# EAGLE schematic adc_microboard (EAGLE 6.2)

## Sheet 1 of 2
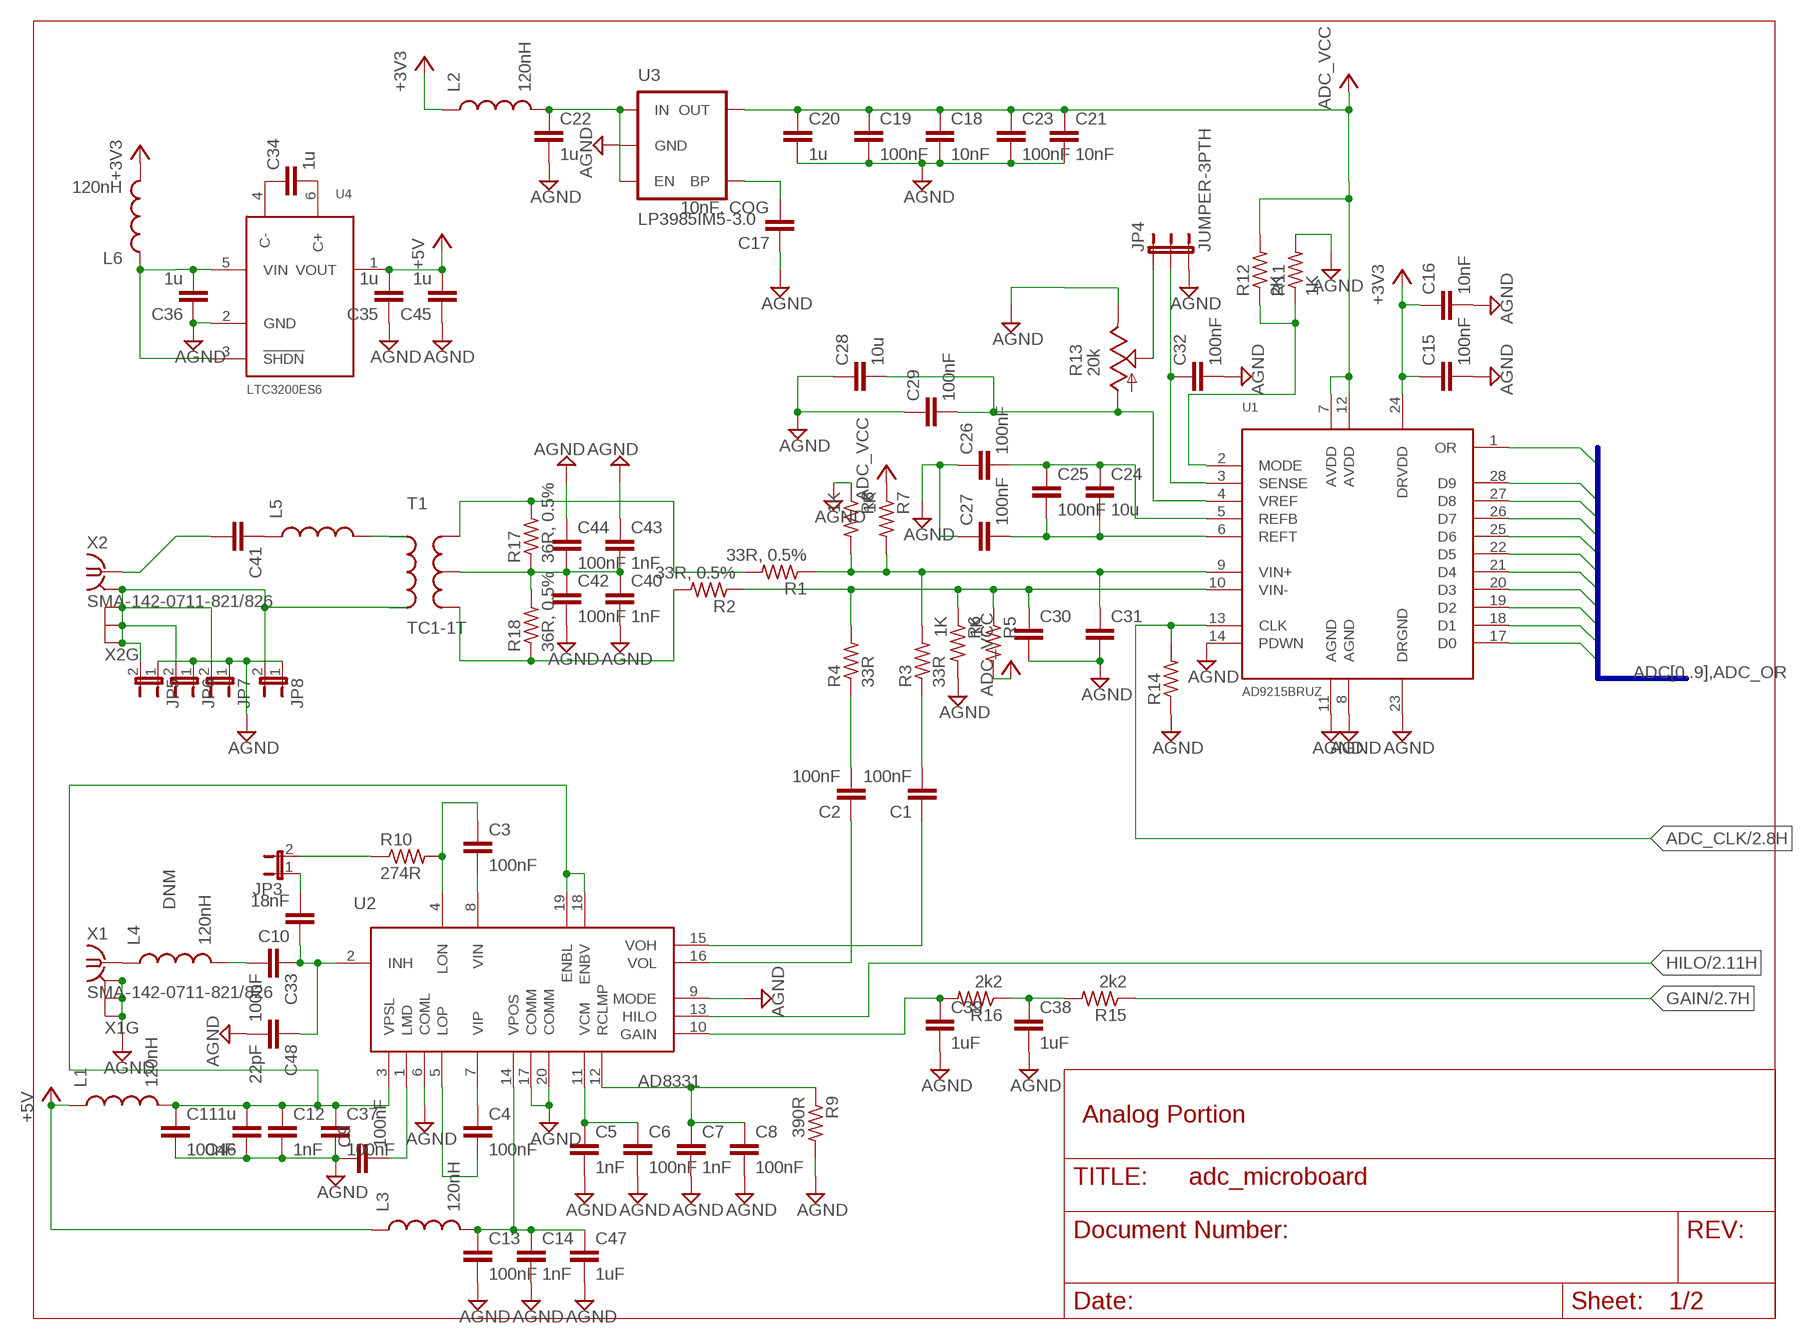
[diagram p0: schematic, sheet 1]

### Parts
C1  100nF  C-EUC0603K  [C0603K]
C2  100nF  C-EUC0603K  [C0603K]
C3  100nF  C-EUC0402  [C0402]
C4  100nF  C-EUC0402  [C0402]
C5  1nF  C-EUC0402  [C0402]
C6  100nF  C-EUC0402  [C0402]
C7  1nF  C-EUC0402  [C0402]
C8  100nF  C-EUC0402  [C0402]
C9  100nF  C-EUC0402  [C0402]
C10  18nF  C-EUC0603  [C0603]
C11  100nF  C-EUC0402  [C0402]
C12  1nF  C-EUC0402  [C0402]
C13  100nF  C-EUC0402  [C0402]
C14  1nF  C-EUC0402  [C0402]
C15  100nF  C-EUC0402  [C0402]
C16  10nF  C-EUC0402  [C0402]
C17  10nF, COG  C-EUC0402  [C0402]
C18  10nF  C-EUC0402  [C0402]
C19  100nF  C-EUC0402  [C0402]
C20  1u  C-EUC0603  [C0603]
C21  10nF  C-EUC0402  [C0402]
C22  1u  C-EUC0603  [C0603]
C23  100nF  C-EUC0402  [C0402]
C24  10u  C-EUC0603  [C0603]
C25  100nF  C-EUC0402  [C0402]
C26  100nF  C-EUC0402  [C0402]
C27  100nF  C-EUC0402  [C0402]
C28  10u  C-EUC0603  [C0603]
C29  100nF  C-EUC0402  [C0402]
C30  C-EUC0402  [C0402]
C31  C-EUC0402  [C0402]
C32  100nF  C-EUC0402  [C0402]
C33  100nF  C-EUC0603K  [C0603K]
C34  1u  C-EUC0603  [C0603]
C35  1u  C-EUC0603  [C0603]
C36  1u  C-EUC0603  [C0603]
C37  100nF  C-EUC0402  [C0402]
C38  1uF  C-EUC0603  [C0603]
C39  1uF  C-EUC0603  [C0603]
C40  1nF  C-EUC0402  [C0402]
C41  C-EUC0603K  [C0603K]
C42  100nF  C-EUC0402  [C0402]
C43  1nF  C-EUC0402  [C0402]
C44  100nF  C-EUC0402  [C0402]
C45  1u  C-EUC0603  [C0603]
C46  1u  C-EUC0402  [C0402]
C47  1uF  C-EUC0402  [C0402]
C48  22pF  C-EUC0603  [C0603]
JP3  JUMPER-2SMD-NC  [SJ_2S]
JP4  JUMPER-3PTH  [1X03]
JP5  JUMPER-2SMD-NC  [SJ_2S]
JP6  JUMPER-2SMD-NC  [SJ_2S]
JP7  JUMPER-2SMD-NC  [SJ_2S]
JP8  JUMPER-2SMD-NC  [SJ_2S]
L1  120nH  INDUCTOR0603  [0603]
L2  120nH  INDUCTOR0603  [0603]
L3  120nH  INDUCTOR0603  [0603]
L4  120nH  INDUCTOR0603  [0603]
L5  INDUCTOR0603  [0603]
L6  120nH  INDUCTOR0603  [0603]
R1  33R, 0.5%  R-US_R0603  [R0603]
R2  33R, 0.5%  R-US_R0603  [R0603]
R3  33R  R-US_R0603  [R0603]
R4  33R  R-US_R0603  [R0603]
R5  1K  R-US_R0402  [R0402]
R6  1K  R-US_R0402  [R0402]
R7  1K  R-US_R0402  [R0402]
R8  1K  R-US_R0402  [R0402]
R9  390R  R-US_R0603  [R0603]
R10  274R  R-US_R0603  [R0603]
R11  1K  R-US_R0402  [R0402]
R12  2K  R-US_R0603  [R0603]
R13  20k  TRIM_US-3361P  [3361P]
R14  R-US_R0603  [R0603]
R15  2k2  R-US_R0603  [R0603]
R16  2k2  R-US_R0603  [R0603]
R17  36R, 0.5%  R-US_R0603  [R0603]
R18  36R, 0.5%  R-US_R0603  [R0603]
T1  TC1-1T  [AT224-1A]
U1  AD9215BRUZ  [TSSOP28]
U2  AD8331  [QSOP20]
U3  LP3985IM5-3.0  V_REG_LDOSMD  [SOT23-5]
U4  LTC3200ES6  [SOT23-6L]
X1  SMA-142-0711-821/826  [J502-ND-142-0711-821/826]
X2  SMA-142-0711-821/826  [J502-ND-142-0711-821/826]

### Nets
+3V3: C15.1 C16.1 L2.1 L6.2 U1.24(DRVDD) ; also sheet 2
+5V: C35.2 C45.2 L1.1 L3.1 U4.1(VOUT)
ADC0: U1.17(D0) ; also sheet 2
ADC1: U1.18(D1) ; also sheet 2
ADC2: U1.19(D2) ; also sheet 2
ADC3: U1.20(D3) ; also sheet 2
ADC4: U1.21(D4) ; also sheet 2
ADC5: U1.22(D5) ; also sheet 2
ADC6: U1.25(D6) ; also sheet 2
ADC7: U1.26(D7) ; also sheet 2
ADC8: U1.27(D8) ; also sheet 2
ADC9: U1.28(D9) ; also sheet 2
ADC_CLK: R14.2 U1.13(CLK) ; also sheet 2
ADC_OR: U1.1(OR) ; also sheet 2
ADC_VCC: C18.1 C19.1 C20.1 C21.1 C23.1 R5.2 R7.1 R12.2 U1.7(AVDD) U1.12(AVDD) U3.5(OUT)
AGND: C5.2 C6.2 C7.2 C8.2 C9.1 C11.2 C12.2 C13.2 C14.2 C15.2 C16.2 C17.1 C18.2 C19.2 C20.2 C21.2 C22.2 C23.2 C26.1 C27.1 C28.1 C29.1 C30.2 C31.2 C32.2 C35.1 C36.1 C37.2 C38.2 C39.2 C40.2 C42.2 C43.1 C44.1 C45.1 C46.1 C47.2 C48.2 JP4.3 JP5.1 JP6.1 JP7.1 JP8.1 R6.2 R8.1 R9.2 R11.2 R13.1(E) R14.1 U1.8(AGND) U1.11(AGND) U1.14(PDWN) U1.23(DRGND) U2.6(COML) U2.9(MODE) U2.17(COMM) U2.20(COMM) U3.2(GND) U4.2(GND) X1.G@1(GND) X1.G@2(GND) X1.G@3(GND) X1.G@4(GND) ; also sheet 2
GAIN: R15.1 ; also sheet 2
HILO: U2.13(HILO) ; also sheet 2
N$1: C31.1 R1.1 R3.2 R7.2 R8.2 U1.9(VIN+)
N$2: JP4.1 R13.2(S)
N$3: C1.2 R3.1
N$4: C2.2 R4.1
N$5: C4.2 U2.5(LOP)
N$6: C2.1 U2.16(VOL)
N$7: C1.1 U2.15(VOH)
N$8: C4.1 U2.7(VIP)
N$9: C3.2 U2.8(VIN)
N$10: C3.1 R10.2 U2.4(LON)
N$11: C5.1 C6.1 U2.11(VCM)
N$12: C7.1 C8.1 R9.1 U2.12(RCLMP)
N$13: C9.2 U2.1(LMD)
N$14: C10.2 JP3.1
N$15: JP3.2 R10.1
N$16: C10.1 C33.1 C48.1 U2.2(INH)
N$17: C17.2 U3.4(BP)
N$19: L4.1 X1.1
N$20: C13.1 C14.1 C47.1 L3.2 U2.14(VPOS)
N$21: C22.1 L2.2 U3.1(IN) U3.3(EN)
N$23: C24.1 C25.1 C26.2 U1.5(REFB)
N$24: C41.1 L5.1
N$25: C24.2 C25.2 C27.2 U1.6(REFT)
N$26: C30.1 R2.1 R4.2 R5.1 R6.1 U1.10(VIN-)
N$27: C28.2 C29.2 R13.3(A) U1.4(VREF)
N$28: C32.1 JP4.2 U1.3(SENSE)
N$29: R11.1 R12.1 U1.2(MODE)
N$30: L5.2 T1.6(P1)
N$31: JP5.2 JP6.2 JP7.2 JP8.2 T1.4(P2) X2.G@1(GND) X2.G@2(GND) X2.G@3(GND) X2.G@4(GND)
N$32: R1.2 R17.2 T1.1(S1)
N$33: C34.1 U4.4(C-)
N$34: C34.2 U4.6(C+)
N$35: C11.1 C12.1 C37.1 C46.2 L1.2 U2.3(VPSL) U2.18(ENBV) U2.19(ENBL)
N$36: C38.1 R15.2 R16.1
N$37: C39.1 R16.2 U2.10(GAIN)
N$38: R2.2 R18.1 T1.3(S2)
N$39: C40.1 C42.1 C43.2 C44.2 R17.1 R18.2 T1.2(ST)
N$43: C41.2 X2.1
N$45: C36.2 L6.1 U4.3(!SHDN) U4.5(VIN)
N$46: C33.2 L4.2

### Buses
ADC[0..9],ADC_OR

### Notes on the sheet
- DNM
- Analog Portion

## Sheet 2 of 2
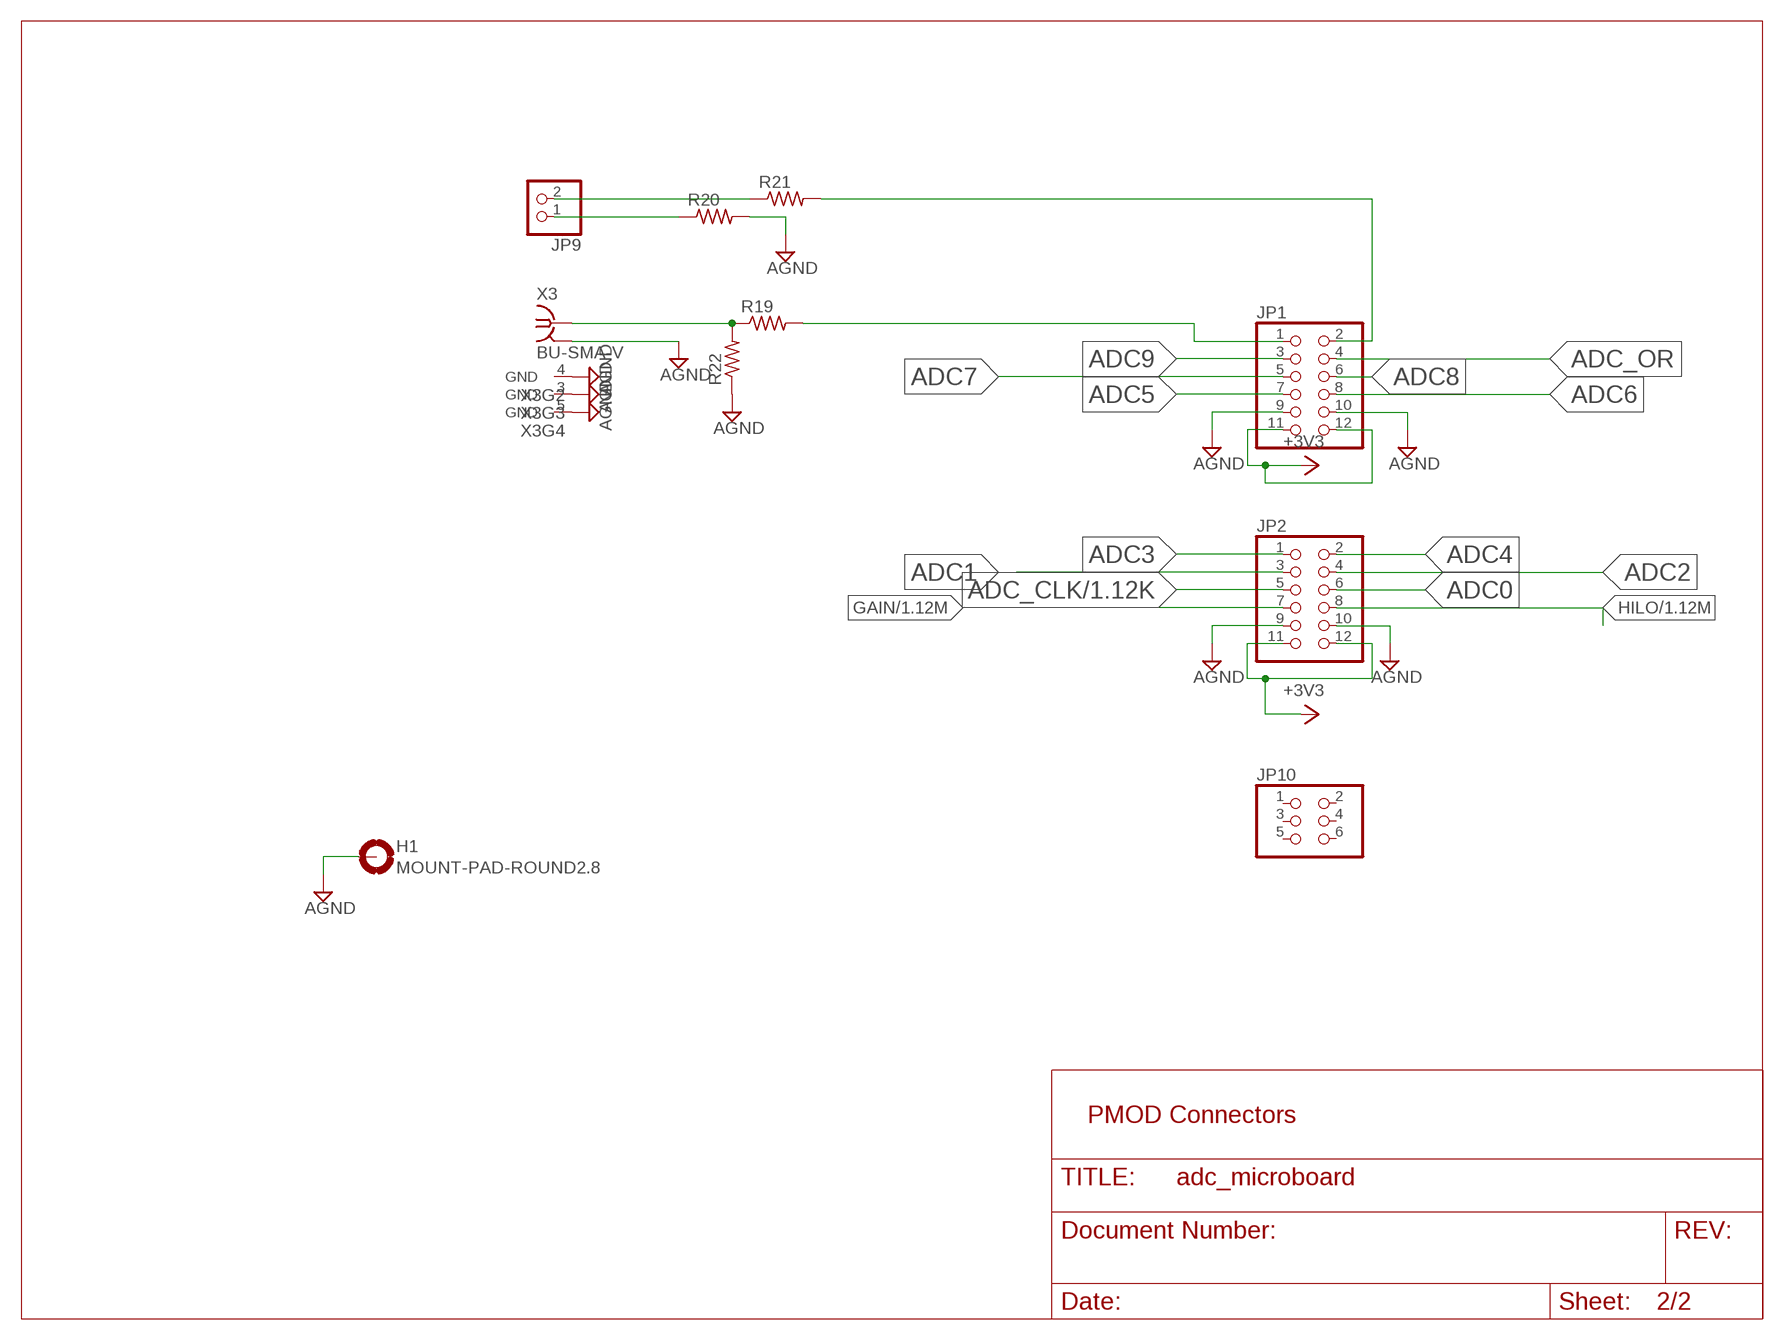
[diagram p1: schematic, sheet 2]

### Parts
H1  MOUNT-PAD-ROUND2.8  [2,8-PAD]
JP1  PINHD-2X6  [2X06]
JP2  PINHD-2X6  [2X06]
JP9  PINHD-1X2/90  [1X02/90]
JP10  PINHD-2X3  [2X03]
R19  R-US_R0603  [R0603]
R20  R-US_R0603  [R0603]
R21  R-US_R0603  [R0603]
R22  R-US_R0603  [R0603]
X3  BU-SMA-V  [BU-SMA-V]

### Nets
+3V3: JP1.11 JP1.12 JP2.11 JP2.12 ; also sheet 1
ADC0: JP2.6 ; also sheet 1
ADC1: JP2.3 ; also sheet 1
ADC2: JP2.4 ; also sheet 1
ADC3: JP2.1 ; also sheet 1
ADC4: JP2.2 ; also sheet 1
ADC5: JP1.7 ; also sheet 1
ADC6: JP1.8 ; also sheet 1
ADC7: JP1.5 ; also sheet 1
ADC8: JP1.6 ; also sheet 1
ADC9: JP1.3 ; also sheet 1
ADC_CLK: JP2.5 ; also sheet 1
ADC_OR: JP1.4 ; also sheet 1
AGND: H1.B2,8(MOUNT) JP1.9 JP1.10 JP2.9 JP2.10 R20.2 R22.1 X3.2(GND) X3.3(GND) X3.4(GND) X3.5(GND) ; also sheet 1
GAIN: JP2.7 ; also sheet 1
HILO: JP2.8 ; also sheet 1
N$18: JP1.1 R19.2
N$40: R19.1 R22.2 X3.1
N$41: JP9.1 R20.1
N$42: JP9.2 R21.1
N$44: JP1.2 R21.2
Unconnected: JP10.1 JP10.2 JP10.3 JP10.4 JP10.5 JP10.6

### Notes on the sheet
- PMOD Connectors

## Library data of the parts
C1-C4 C28 C30 C31 C33 C38 C39 C41 = rcl:C-EU: CAPACITOR, European symbol
C5 C7 C12 C14 C40 C43 C47 = rcl:C-EU: CAPACITOR, European symbol; DIGIKEY#: 445-4924-1-ND; PART#: C1005X7R1E102K
C6 C8 C9 C11 C13 C15 C19 C23 C25-C27 C29 C32 C37 C42 C44 = rcl:C-EU: CAPACITOR, European symbol; DIGIKEY#: 490-1318-1-ND; PART#: GRM155R61A104KA01D
C10 C48 = rcl:C-EU: CAPACITOR, European symbol; DIGIKEY#: 587-1099-1-ND; MANF#: LMK107SD183JA-T
C16 = rcl:C-EU: CAPACITOR, European symbol; DIGIKEY#: 490-1312-1-ND; MANF#: GRM155R71E103KA01D
C17 = rcl:C-EU: CAPACITOR, European symbol; DIGIKEY#: 445-2664-1-ND
C18 C21 = rcl:C-EU: CAPACITOR, European symbol; DIGIKEY#: 490-1312-1-ND; DIIGKEY#: 490-1312-1-ND; MANF#: GRM155R71E103KA01D; PART#: GRM155R71E103KA01D
C20 C22 C34-C36 C45 C46 = rcl:C-EU: CAPACITOR, European symbol; DIGIKEY#: 490-1543-1-ND; PART#: GRM188R61A105KA61D
C24 = rcl:C-EU: CAPACITOR, European symbol; DIGIKEY#: C1608X5R0J106K
H1 = holes:MOUNT-PAD-ROUND: MOUNTING PAD, round
JP1 = pinhead:PINHD-2X6: PIN HEADER; DIGIKEY#: 609-3373-ND
JP2 = pinhead:PINHD-2X6: PIN HEADER
JP3 JP5-JP8 = SparkFun:JUMPER-2: Jumper Basic 0.1" spaced jumper. Use with breakaway headers.
JP4 = SparkFun:JUMPER-3
JP9 = pinhead:PINHD-1X2: PIN HEADER; DIGIKEY#: WM2711-ND
JP10 = pinhead:PINHD-2X3: PIN HEADER
L1 = SparkFun:INDUCTOR: Inductors Basic Inductor/Choke - 0603 and 1206. Footprints are not proven and vary greatly between part numbers.; DIGIKEY#: 445-6234-1-ND; PART#: MLF1608DR12M
L2-L6 = SparkFun:INDUCTOR: Inductors Basic Inductor/Choke - 0603 and 1206. Footprints are not proven and vary greatly between part numbers.
R1 = adafruit:R-US_: RESISTOR, American symbol; DIGIKEY#: RR08Q33DCT-ND
R2-R4 R6-R9 R11 R12 R14-R16 R19-R22 = adafruit:R-US_: RESISTOR, American symbol
R5 = adafruit:R-US_: RESISTOR, American symbol; DIGIKEY#: RHM1.00KCDCT-ND
R10 = adafruit:R-US_: RESISTOR, American symbol; DIGIKEY#: RR08P274DCT-ND
R13 = customs:TRIM_US-: POTENTIOMETER; DIGIKEY#: 3361P-203GLFCT-ND; PART#: 3361P-1-203GLF
R17 R18 = adafruit:R-US_: RESISTOR, American symbol; DIGIKEY#: RR08Q36DCT-ND
T1 = customs:TC1-1T
U1 = customs:AD9215BRUZ; DIGIKEY#: AD9215BRUZ-105-ND
U2 = customs:AD8331; DIGIKEY#: AD8331ARQZ-ND; PART#: AD8331ARQZ
U3 = SparkFun:V_REG_LDO: Voltage Regulator LDO Standard 150mA LDO voltage regulator in SOT-23 layout. Micrel part MIC5205. BP (by-pass) pin is used to lower output noise with 470pF cap.; DIGIKEY#: LP3985IM5-3.0CT-ND
U4 = customs:LTC3200; DIIGKEY#: LTC3200ES6-5#TRMPBFCT-ND; PART#: LTC3200ES6-5#TRMPBF
X1 X2 = con-coax:SMA-: SMA 50 Ohm End Launch Jack Receptacle - Round Contact Johnson Components Source: www.johnsoncomponents.com .. J502-ND.pdf; DIGIKEY#: CONSMA003.062-ND; MF: JOHNSON COMPONENTS; MPN: 142-0711-821; OC_FARNELL: 1019328; OC_NEWARK: 16F3627
X3 = con-coax:BU-SMA-V: FEMALE SMA CONNECTOR Radiall distributor RS 112-3794; OC_FARNELL: unknown; OC_NEWARK: unknown